# Altium schematic sheet AmplifierOutput.SchDoc
size A
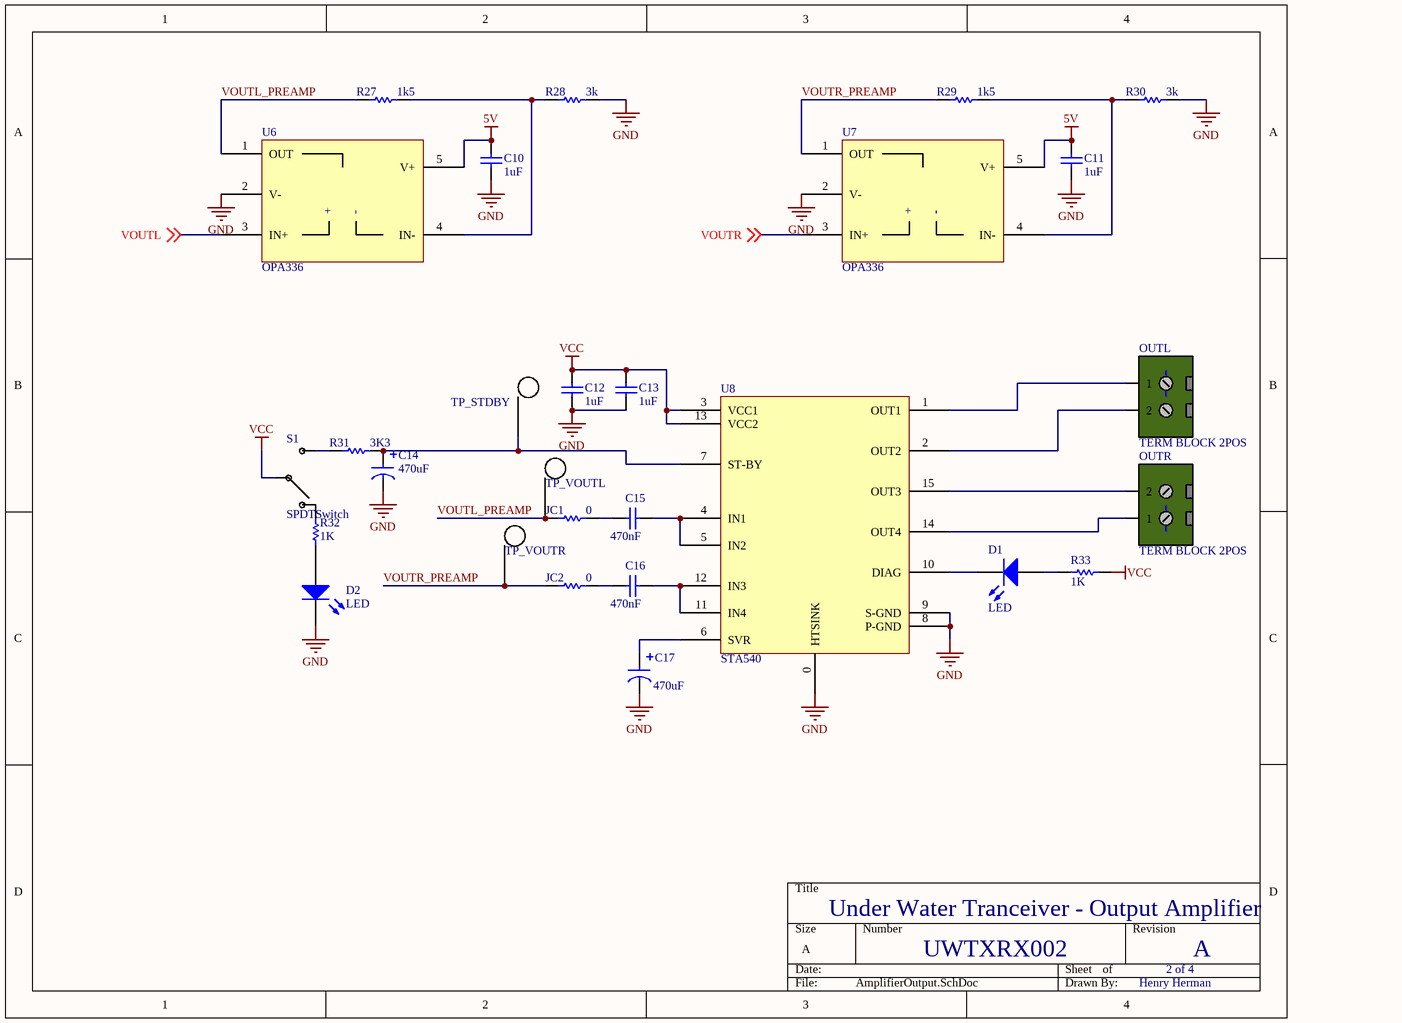
[diagram p0: AmplifierOutput.SchDoc]

## Parts
C10  value 1uF  [SM/C_0805]  (hidden comment: CAP)
C11  value 1uF  [SM/C_0805]  (hidden comment: CAP)
C12  value 1uF  [SM/C_0805]  (hidden comment: CAP)
C13  value 1uF  [SM/C_0805]  (hidden comment: CAP)
C14  value 470uF  [SM/CT_6032_12]  (hidden comment: CAP_POL)
C15  value 470nF  [SM/C_0805]  (hidden comment: CAP)
C16  value 470nF  [SM/C_0805]  (hidden comment: CAP)
C17  value 470uF  [SM/CT_6032_12]  (hidden comment: CAP_POL)
D1  LED  [LED-0805]
D2  LED  [LED-0805]
JC1  value 0  [SM/R_0805]  (hidden comment: Res)
JC2  value 0  [SM/R_0805]  (hidden comment: Res)
OUTL  TERM BLOCK 2POS  [Conn-ScrewTerminal-2pin-Phoenix]
OUTR  TERM BLOCK 2POS  [Conn-ScrewTerminal-2pin-Phoenix]
R27  value 1k5  [SM/R_0805]  (hidden comment: Res)
R28  value 3k  [SM/R_0805]  (hidden comment: Res)
R29  value 1k5  [SM/R_0805]  (hidden comment: Res)
R30  value 3k  [SM/R_0805]  (hidden comment: Res)
R31  value 3K3  [SM/R_0805]  (hidden comment: Res)
R32  value 1K  [SM/R_0805]  (hidden comment: Res)
R33  value 1K  [SM/R_0805]  (hidden comment: Res)
S1  SPDTSwitch  [SPDTSwitch]
TP_STDBY  TEST_PT  [TEST_PT_SMD]  (value not drawn)
TP_VOUTL  TEST_PT  [TEST_PT_SMD]  (value not drawn)
TP_VOUTR  TEST_PT  [TEST_PT_SMD]  (value not drawn)
U6  OPA336  [SOT23-5 -TI]
U7  OPA336  [SOT23-5 -TI]
U8  STA540  [STA540_Multiwatt15]

## Nets
5V: C10.1 C11.1 U6.5(V+) U7.5(V+)
GND: C10.2 C11.2 C12.1 C13.1 C14.2 C17.2 D2.2(K) R28.2 R30.2 U6.2(V-) U7.2(V-) U8.0(HTSINK) U8.8(P-GND) U8.9(S-GND)
VCC: C12.2 C13.2 R33.1 S1.2(C) U8.3(VCC1) U8.13(VCC2)
VOUTL: U6.3(IN+) ; off-sheet VOUTL
VOUTL_PREAMP: JC1.1 R27.1 TP_VOUTL.1(TP?) U6.1(OUT)
VOUTR: U7.3(IN+) ; off-sheet VOUTR
VOUTR_PREAMP: JC2.1 R29.1 TP_VOUTR.1(TP?) U7.1(OUT)
NetC14_1: C14.1 R31.2 TP_STDBY.1(TP?) U8.7(ST-BY)
NetC15_1: C15.1 JC1.2
NetC15_2: C15.2 U8.4(IN1) U8.5(IN2)
NetC16_1: C16.1 JC2.2
NetC16_2: C16.2 U8.11(IN4) U8.12(IN3)
NetC17_1: C17.1 U8.6(SVR)
NetD1_1: D1.1(A) R33.2
NetD1_2: D1.2(K) U8.10(DIAG)
NetD2_1: D2.1(A) R32.2
NetOUTL_1: OUTL.1 U8.1(OUT1)
NetOUTL_2: OUTL.2 U8.2(OUT2)
NetOUTR_1: OUTR.1 U8.14(OUT4)
NetOUTR_2: OUTR.2 U8.15(OUT3)
NetR27_2: R27.2 R28.1 U6.4(IN-)
NetR29_2: R29.2 R30.1 U7.4(IN-)
NetR31_1: R31.1 S1.3(P2)
NetR32_1: R32.1 S1.1(P1)

## Notes on the sheet
- Under Water Tranceiver - Output Amplifier
- UWTXRX002
- 2 of 4
- A
- Henry Herman
- (in symbol OPA335) +; -

## Library data of the parts
C14 C17 = CAP_POL: CAP
JC1 JC2 R27-R33 = Res: Resistor; Published: 8-Jun-2000; LatestRevisionDate: 17-Jul-2002; LatestRevisionNote: Re-released for DXP Platform.; PackageReference: AXIAL-0.3; Publisher: Altium Limited
OUTL OUTR = 2Pin-PhoenixTerminalBlock
U6 U7 = OPA335